# Altium schematic sheet Antenna.SchDoc
size A; SheetNumber: 3; SheetTotal: 4
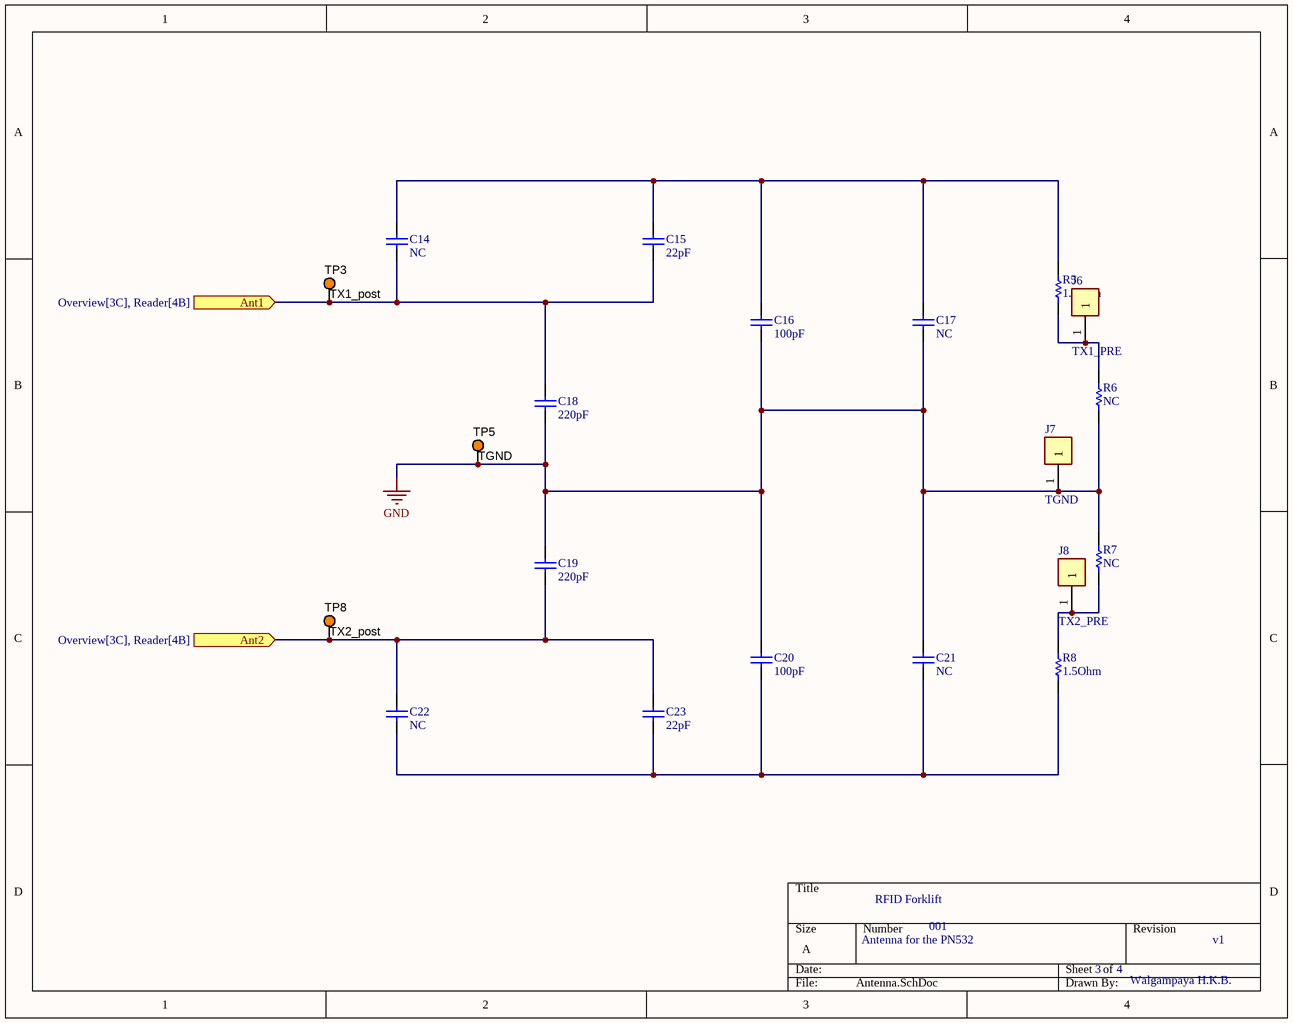
[diagram p0: Antenna.SchDoc]

## Parts
C14  NC  [CAPC2013X140X50LL20T25]
C15  22pF  [CAPC2013X140X50LL20T25]
C16  100pF  [CAPC2013X140X50LL20T25]
C17  NC  [CAPC2013X140X50LL20T25]
C18  220pF  [CAPC2013X140X50LL20T25]
C19  220pF  [CAPC2013X140X50LL20T25]
C20  100pF  [CAPC2013X140X50LL20T25]
C21  NC  [CAPC2013X140X50LL20T25]
C22  NC  [CAPC2013X140X50LL20T25]
C23  22pF  [CAPC2013X140X50LL20T25]
J6  TX1_PRE  [FP-5000-MFG]
J7  TGND  [FP-5000-MFG]
J8  TX2_PRE  [FP-5000-MFG]
R5  1.5Ohm  [RESC3116X65X40ML10T20]
R6  NC  [RESC1005X40X25ML05T10]
R7  NC  [RESC1005X40X25ML05T10]
R8  1.5Ohm  [RESC3116X65X40ML10T20]
TP3  TX1_post  [KSTN-5003]
TP5  TGND  [KSTN-5003]
TP8  TX2_post  [KSTN-5003]

## Ports
Ant1 (in, see Overview[3C], Reader[4B]), Ant2 (in, see Overview[3C], Reader[4B])

## Nets
GND: C16.1 C17.1 C18.1 C19.2 C20.2 C21.2 J7.1 R6.1 R7.2 TP5.1
Ant1: C14.1 C15.1 C18.2 TP3.1 ; port Ant1
Ant2: C19.1 C22.2 C23.2 TP8.1 ; port Ant2
NetC14_2: C14.2 C15.2 C16.2 C17.2 R5.2
NetC20_1: C20.1 C21.1 C22.1 C23.1 R8.1
NetJ6_1: J6.1 R5.1 R6.2
NetJ8_1: J8.1 R7.1 R8.2

## Notes on the sheet
- RFID Forklift
- Antenna for the PN532
- 001
- 3
- 4
- v1
- Walgampaya H.K.B.

## Library data of the parts
C14 C15 C17-C23 = CMP-2007-04699-1: 08055C221KAT2A; Manufacturer: AVX Interconnect / Elco; Part Number: 08055C221KAT2A
C16 = CMP-2007-04699-1: 08055C221KAT2A / 0805; Manufacturer: AVX Interconnect / Elco; Part Number: 08055C221KAT2A
J6-J8 = CMP-19636-000027-1: PC TEST POINT MINIATURE RED; Outside Diameter: 2.54mm; Body Material: Bronze; Number of Contacts: 1; Insulation: Insulated; Inside Diameter: 1.27mm; Hole Diameter: 1.6mm; Plating: Silver; Length: 7.62mm; Package Quantity: 100; Number of Ports: 1; Contact Material: Bronze; Orientation: Straight; RoHS Compliant: Yes; Housing Color: Red; Height: 0.3inch; Series: THM; Lead Free: Lead Free; Color: Red; Contact Plating: Tin; Mount: PCB; Packaging: Bulk; REACH SVHC: No SVHC; Flammability Rating: UL94 V-0; Material: Nylon
R5 R8 = CMP-2100-03677-1: Chip Resistor, 10 Ohm, +/- 1%, 0.25 W, -55 to 155 degC, 1206 (3216 Metric), RoHS, Tape and Reel; Manufacturer: Yageo; Voltage Rating (DC): 200V; Resistance: 10Ohm; Power Rating: 250mW; Temperature Coefficient: 200ppm/degreesC; Military Standard: Not; Package Description: 2-Pin Surface Mount Device, Body 3.1 x 1.6 mm; Packaging: TapeandReel; Datasheet Version: Rev. 5, 10/2016; Length: 3.1mm; Manufacturer URL: http://www.yageo.com/; Voltage Rating: 200V; Height: 0.026inch; REACH SVHC: Unknown; Max Operating Temperature: 155degC; Case Code (Imperial): 1206; Package Reference: 1206.0; RoHSCompliant: true; Termination: SMD/SMT; Lead Free: LeadFree; Composition: ThickFilm; Tolerance: 1%; Package Quantity: 1; Min Operating Temperature: -55degC; Datasheet URL: http://www.yageo.com/NewPortal/yageodocoutput?fileName=/pdf/R-Chip/PYu-RC_Group_51_RoHS_L_5.pdf; Number of Pins: 2; Width: 0.063inch; Case Code (Metric): 3216; Max Power Dissipation: 250mW; Depth: 1.6mm; Number of Terminations: 2; Case/Package: 1206
R6 R7 = CMP-2002-07344-1: Part Number: RC0402FR-07100RL; Manufacturer: Yageo / Phycomp
TP3 TP5 TP8 = CMP-1672-00009-1: Test Point, Orange, 1-Pin THD, RoHS; Peak Reverse Current: 600 uA; Forward Current: 3 A; Max Surge Current: 80 A; Forward Voltage: 1.08 V; Max Operating Temperature: 150 degC; PackageReference: 5003; Pins: 2; ComponentLink2URL: http://keyelco.com/userAssets/file/M65p56.pdf; PackageDescription: 1-Pin Through Hole Device, Dia 2.54 mm; Weight: 0.01 lb; Diameter: 5.3 mm; Mount: Through Hole; Package Quantity: 500; Packaging: Bulk; Min Operating Temperature: -65 degC; ComponentLink1Description: Manufacturer URL; Height: 0.25 inch; ComponentLink1URL: http://www.keyelco.com/; ComponentLink2Description: Datasheet; Width: 0.25 inch; REACH SVHC: No SVHC; RoHSCompliant: true; Radiation Hardening: No; Length: 9.5 mm; DatasheetVersion: Jun-15